# Altium schematic sheet 201_GridPos2.SchDoc: Grid Position 2 / USB 1
size A2; Organization: Greenfield Tech Solutions; Address1: Molendreef 33; Address2: Ossendrecht; Address3: 4641CS; Address4: The Netherlands; SheetNumber: 3; SheetTotal: 9
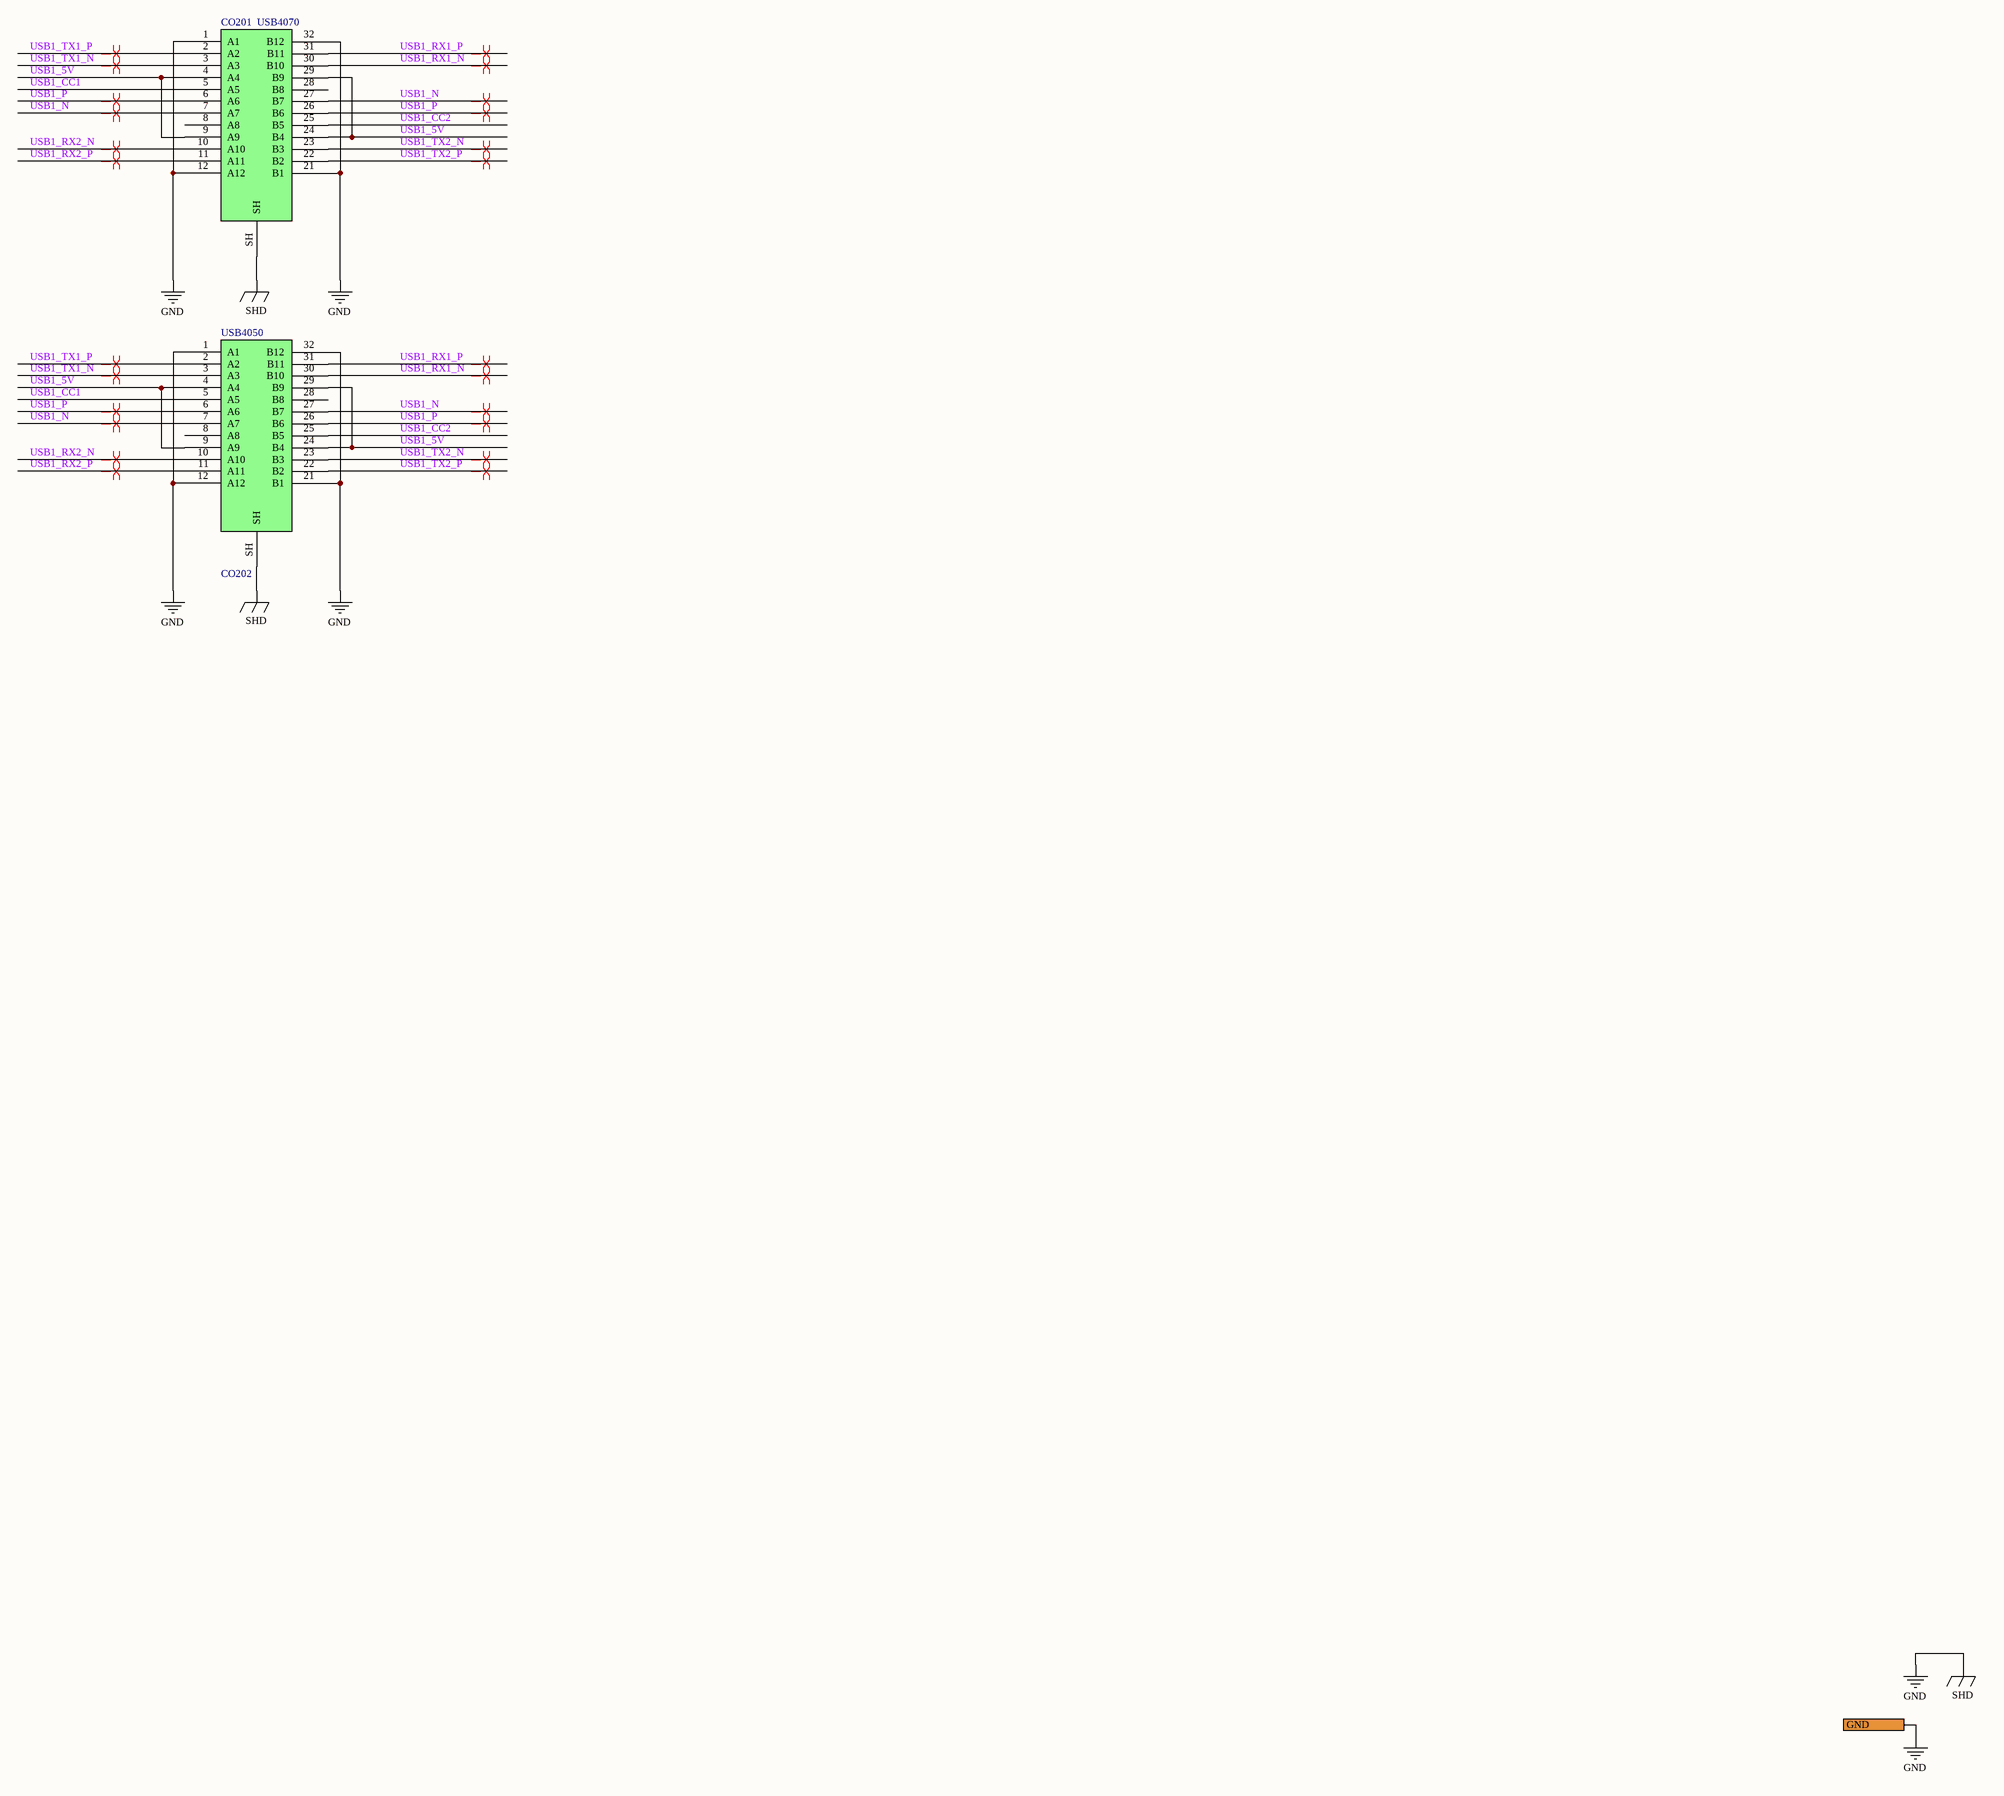
[diagram p0: 201_GridPos2.SchDoc]

## Parts
CO201  USB4070  [USB4070-30-C]
CO202  USB4050  [USB4050-30-A]

## Ports
GND

## Nets
GND: CO201.1(A1) CO201.12(A12) CO201.21(B1) CO201.32(B12) CO201.SH CO202.1(A1) CO202.12(A12) CO202.21(B1) CO202.32(B12) CO202.SH ; port GND  [also labelled SHD]
USB1_5V: CO201.4(A4) CO201.9(A9) CO201.24(B4) CO201.29(B9) CO202.4(A4) CO202.9(A9) CO202.24(B4) CO202.29(B9)
USB1_CC1: CO201.5(A5) CO202.5(A5)
USB1_CC2: CO201.25(B5) CO202.25(B5)
USB1_N: CO201.7(A7) CO201.27(B7) CO202.7(A7) CO202.27(B7)
USB1_P: CO201.6(A6) CO201.26(B6) CO202.6(A6) CO202.26(B6)
USB1_RX1_N: CO201.30(B10) CO202.30(B10)
USB1_RX1_P: CO201.31(B11) CO202.31(B11)
USB1_RX2_N: CO201.10(A10) CO202.10(A10)
USB1_RX2_P: CO201.11(A11) CO202.11(A11)
USB1_TX1_N: CO201.3(A3) CO202.3(A3)
USB1_TX1_P: CO201.2(A2) CO202.2(A2)
USB1_TX2_N: CO201.23(B3) CO202.23(B3)
USB1_TX2_P: CO201.22(B2) CO202.22(B2)

Not connected (* = marked no-connect by the designer): CO201 8(A8) 28(B8); CO202 8(A8) 28(B8)

## Layout directives
differential pair; differential pair class USB3: USB1_N, USB1_P, USB1_RX1_N, USB1_RX1_P, USB1_RX2_N, USB1_RX2_P, USB1_TX1_N, USB1_TX1_P, USB1_TX2_N, USB1_TX2_P

## Notes on the sheet
- Title
- Size:
- Date:
- File:
- A2
- Number:
- Time:
- Revision:
- Sheet
- of

## Library data of the parts
CO201 = CO0021: USB4070-30-C; Part Number: CO0021; ID: 16; RefVal: USB4070; ManfactPart: USB4070-30-C
CO202 = CO0039: USB C connector Receptacle Horizontal; Part Number: CO0039; ID: 39; RefVal: USB4050; ManfactPart: USB4050-30-A